# Altium schematic sheet 03_Power Tree.SchDoc
size A3
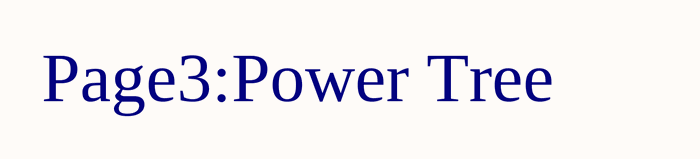
[diagram p0: 03_Power Tree.SchDoc]

## Notes on the sheet
- Page3:Power Tree
- Drawn by
- Project
- Title
- Version
- Sheet of
- Date